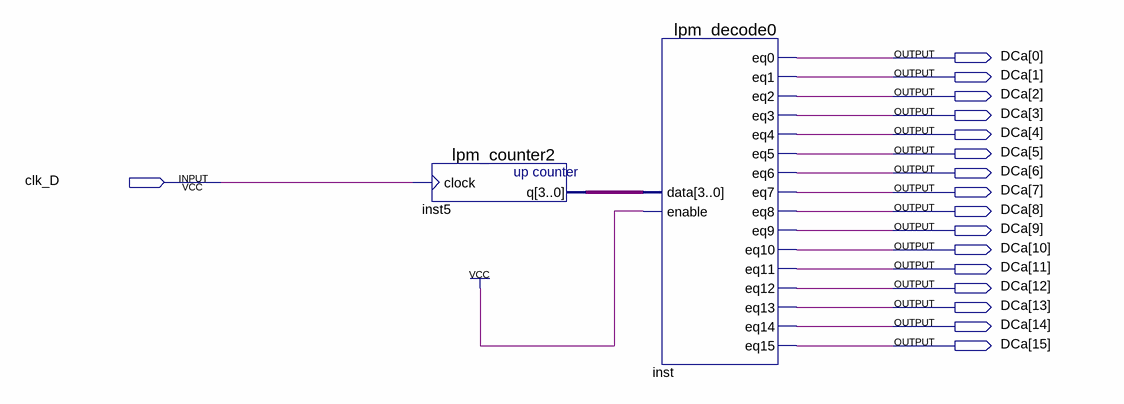
[diagram p0: schematic sheet]
// Quartus schematic Block3.bdf as structural Verilog: 2 symbols, 17 pins
module Block3 (
  input  clk_D,
  output [15:0] DCa
);

  wire [3:0] inst5_q;

  lpm_counter2 inst5 (.clock(clk_D), .q(inst5_q));
  lpm_decode0 inst (
    .data(inst5_q), .enable(1'b1), .eq0(DCa[0]), .eq1(DCa[1]), .eq2(DCa[2]), .eq3(DCa[3]), .eq4(DCa[4]),
    .eq5(DCa[5]), .eq6(DCa[6]), .eq7(DCa[7]), .eq8(DCa[8]), .eq9(DCa[9]), .eq10(DCa[10]), .eq11(DCa[11]),
    .eq12(DCa[12]), .eq13(DCa[13]), .eq14(DCa[14]), .eq15(DCa[15]));
endmodule
